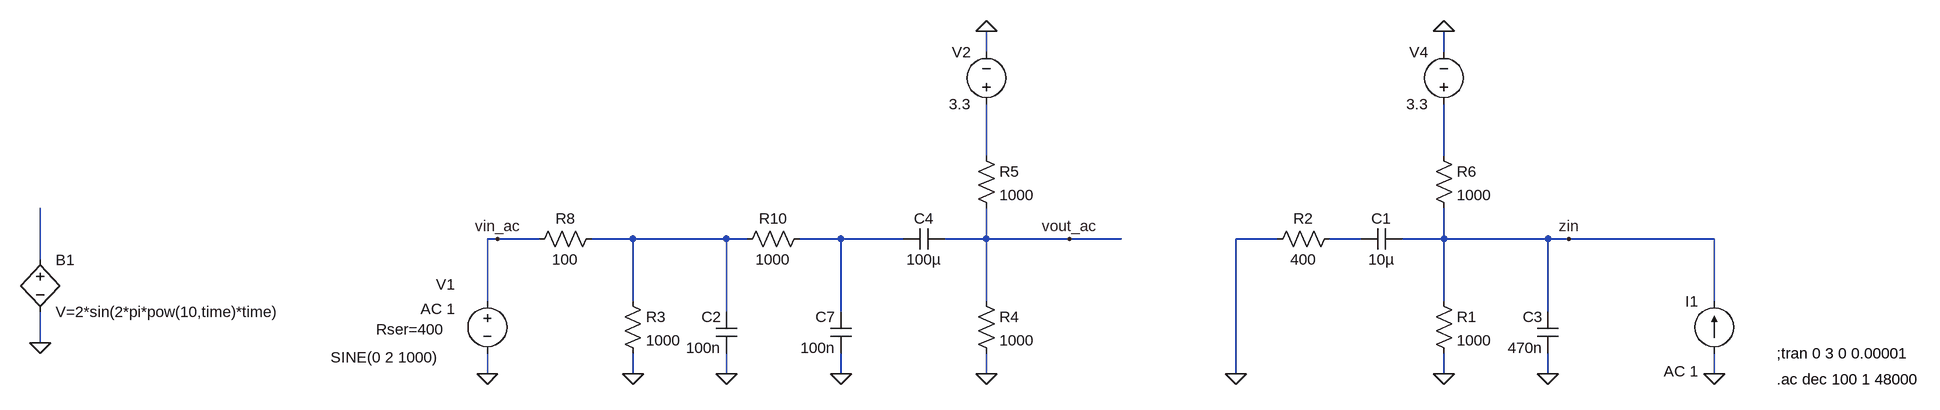
[diagram p0: schematic antialising_input.asc]
antialising_input.asc, the LTspice schematic file:
Version 4
SHEET 1 1128 680
WIRE -368 -80 -368 -112
WIRE 336 -80 336 -112
WIRE -368 80 -368 0
WIRE 336 80 336 0
WIRE -1120 208 -1136 208
WIRE -1056 208 -1120 208
WIRE -912 208 -976 208
WIRE -768 208 -912 208
WIRE -736 208 -768 208
WIRE -592 208 -656 208
WIRE -496 208 -592 208
WIRE -368 208 -368 160
WIRE -368 208 -432 208
WIRE -240 208 -368 208
WIRE -160 208 -240 208
WIRE 80 208 16 208
WIRE 208 208 160 208
WIRE 336 208 336 160
WIRE 336 208 272 208
WIRE 496 208 336 208
WIRE 528 208 496 208
WIRE 752 208 528 208
WIRE -1824 240 -1824 160
WIRE -1136 304 -1136 208
WIRE -912 304 -912 208
WIRE -368 304 -368 208
WIRE 336 304 336 208
WIRE 752 304 752 208
WIRE -768 320 -768 208
WIRE -592 320 -592 208
WIRE 496 320 496 208
WIRE -1824 368 -1824 320
WIRE -1136 416 -1136 384
WIRE -912 416 -912 384
WIRE -768 416 -768 384
WIRE -592 416 -592 384
WIRE -368 416 -368 384
WIRE 16 416 16 208
WIRE 336 416 336 384
WIRE 496 416 496 384
WIRE 752 416 752 384
FLAG 752 416 0
FLAG -368 416 0
FLAG -368 -112 0
FLAG 336 416 0
FLAG 336 -112 0
FLAG 528 208 zin
FLAG 496 416 0
FLAG 16 416 0
FLAG -1824 368 0
FLAG -1136 416 0
FLAG -1120 208 vin_ac
FLAG -240 208 vout_ac
FLAG -912 416 0
FLAG -768 416 0
FLAG -592 416 0
SYMBOL current 752 384 R180
WINDOW 0 24 80 Left 2
WINDOW 3 24 0 Left 2
WINDOW 123 24 -28 Left 2
WINDOW 39 0 0 Left 0
SYMATTR InstName I1
SYMATTR Value ""
SYMATTR Value2 AC 1
SYMBOL cap -432 192 R90
WINDOW 0 0 32 VBottom 2
WINDOW 3 32 32 VTop 2
SYMATTR InstName C4
SYMATTR Value 100µ
SYMBOL res -384 288 R0
SYMATTR InstName R4
SYMATTR Value 1000
SYMBOL res -384 64 R0
SYMATTR InstName R5
SYMATTR Value 1000
SYMBOL voltage -368 16 R180
WINDOW 0 24 96 Left 2
WINDOW 3 24 16 Left 2
WINDOW 123 0 0 Left 0
WINDOW 39 0 0 Left 0
SYMATTR InstName V2
SYMATTR Value 3.3
SYMBOL cap 272 192 R90
WINDOW 0 0 32 VBottom 2
WINDOW 3 32 32 VTop 2
SYMATTR InstName C1
SYMATTR Value 10µ
SYMBOL res 320 288 R0
SYMATTR InstName R1
SYMATTR Value 1000
SYMBOL res 176 192 R90
WINDOW 0 0 56 VBottom 2
WINDOW 3 32 56 VTop 2
SYMATTR InstName R2
SYMATTR Value 400
SYMBOL res 320 64 R0
SYMATTR InstName R6
SYMATTR Value 1000
SYMBOL voltage 336 16 R180
WINDOW 0 24 96 Left 2
WINDOW 3 24 16 Left 2
WINDOW 123 0 0 Left 0
WINDOW 39 0 0 Left 0
SYMATTR InstName V4
SYMATTR Value 3.3
SYMBOL cap 512 384 R180
WINDOW 0 24 56 Left 2
WINDOW 3 24 8 Left 2
SYMATTR InstName C3
SYMATTR Value 470n
SYMBOL bv -1824 224 R0
SYMATTR InstName B1
SYMATTR Value V=2*sin(2*pi*pow(10,time)*time)
SYMBOL voltage -1136 288 R0
WINDOW 3 -241 102 Left 2
WINDOW 123 -103 28 Left 2
WINDOW 39 -171 59 Left 2
WINDOW 0 -79 -10 Left 2
SYMATTR Value SINE(0 2 1000)
SYMATTR Value2 AC 1
SYMATTR SpiceLine Rser=400
SYMATTR InstName V1
SYMBOL res -928 288 R0
SYMATTR InstName R3
SYMATTR Value 1000
SYMBOL res -960 192 R90
WINDOW 0 0 56 VBottom 2
WINDOW 3 32 56 VTop 2
SYMATTR InstName R8
SYMATTR Value 100
SYMBOL cap -752 384 R180
WINDOW 0 24 56 Left 2
WINDOW 3 24 8 Left 2
SYMATTR InstName C2
SYMATTR Value 100n
SYMBOL res -640 192 R90
WINDOW 0 0 56 VBottom 2
WINDOW 3 32 56 VTop 2
SYMATTR InstName R10
SYMATTR Value 1000
SYMBOL cap -576 384 R180
WINDOW 0 24 56 Left 2
WINDOW 3 24 8 Left 2
SYMATTR InstName C7
SYMATTR Value 100n
TEXT 848 424 Left 2 !.ac dec 100 1 48000
TEXT 848 384 Left 2 !;tran 0 3 0 0.00001

The netlist it stands for:
* antialising_input.asc
I1 0 zin AC 1
C4 vout_ac N004 100µ
R4 vout_ac 0 1000
R5 N001 vout_ac 1000
V2 N001 0 3.3
C1 zin N005 10µ
R1 zin 0 1000
R2 N005 0 400
R6 N002 zin 1000
V4 N002 0 3.3
C3 0 zin 470n
B1 N006 0 V=2*sin(2*pi*pow(10,time)*time)
V1 vin_ac 0 SINE(0 2 1000) AC 1 Rser=400
R3 N003 0 1000
R8 N003 vin_ac 100
C2 0 N003 100n
R10 N004 N003 1000
C7 0 N004 100n
.ac dec 100 1 48000
;tran 0 3 0 0.00001
.backanno
.end